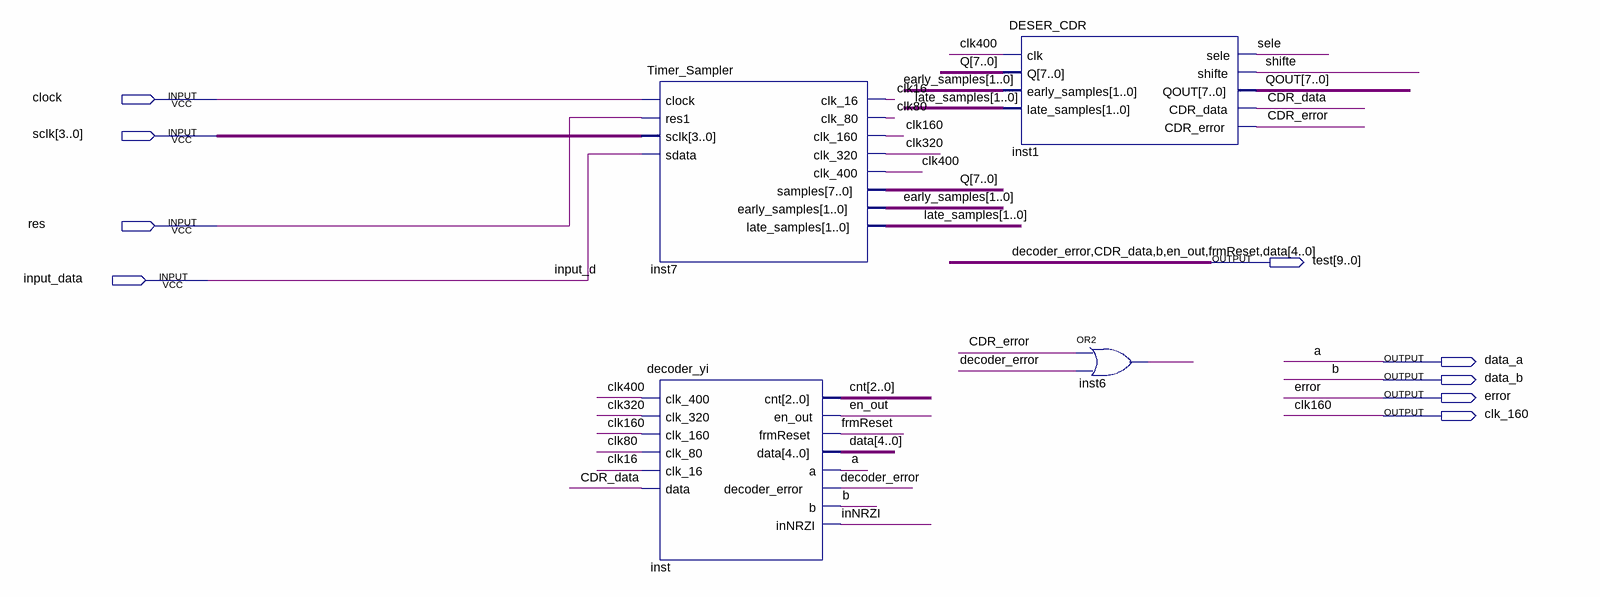
[diagram p0: schematic sheet]
// Quartus schematic DESER400_sampling.bdf as structural Verilog: 4 symbols, 9 pins
module DESER400_sampling (
  input  clock,
  input  [3:0] sclk,
  input  res,
  input  input_data,
  output [9:0] test,
  output data_a,
  output data_b,
  output error,
  output clk_160
);

  wire CDR_error, clk16, clk80, clk320, clk400, inNRZI, inst6_out, sele, shifte;
  wire [1:0] early_samples, late_samples;
  wire [2:0] cnt;
  wire [7:0] Q, QOUT;

  Timer_Sampler inst7 (
    .clock(clock), .res1(res), .sclk(sclk), .sdata(input_data), .clk_16(clk16), .clk_80(clk80),
    .clk_160(clk_160), .clk_320(clk320), .clk_400(clk400), .samples(Q), .early_samples(early_samples),
    .late_samples(late_samples));
  decoder_yi inst (
    .clk_400(clk400), .clk_320(clk320), .clk_160(clk_160), .clk_80(clk80), .clk_16(clk16),
    .data({test[4:1], test[8], test[0]}), .cnt(cnt), .en_out(test[6]), .frmReset(test[5]), .a(data_a),
    .decoder_error(test[9]), .b(data_b), .inNRZI(inNRZI));
  DESER_CDR inst1 (
    .clk(clk400), .Q(Q), .early_samples(early_samples), .late_samples(late_samples), .sele(sele),
    .shifte(shifte), .QOUT(QOUT), .CDR_data(test[8]), .CDR_error(CDR_error));
  or inst6 (inst6_out, CDR_error, test[9]);

  assign test[7] = data_b;

  // Other names for the same wires on the sheet: a = data_a; b = data_b; CDR_data = test[8]; clk160 = clk_160;
  //   data[4:0] = test[4:0]; decoder_error = test[9]; en_out = test[6]; frmReset = test[5]; input_d = input_data
endmodule
